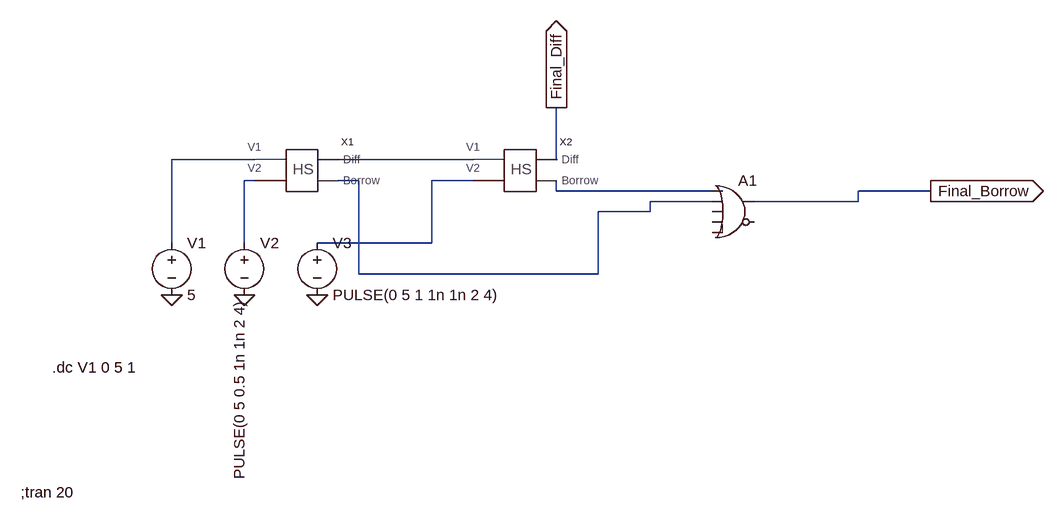
[diagram p0: schematic VTC_Full subtractor.asc]
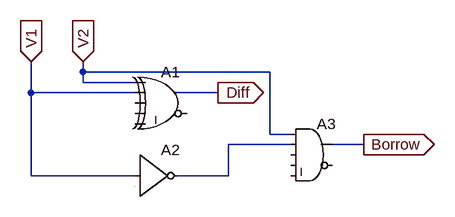
[diagram p1: sub-circuit hs.asc]
VTC_Full subtractor.asc, the LTspice schematic file:
Version 4
SHEET 1 880 680
WIRE -560 -784 -688 -784
WIRE -224 -784 -432 -784
WIRE -96 -784 -96 -864
WIRE -560 -752 -576 -752
WIRE -400 -752 -432 -752
WIRE -224 -752 -288 -752
WIRE -96 -736 -96 -752
WIRE 144 -736 -96 -736
WIRE 480 -736 368 -736
WIRE 144 -720 48 -720
WIRE 368 -720 368 -736
WIRE 368 -720 208 -720
WIRE 48 -704 48 -720
WIRE 48 -704 -32 -704
WIRE -688 -656 -688 -784
WIRE -576 -656 -576 -752
WIRE -288 -656 -288 -752
WIRE -288 -656 -464 -656
WIRE -400 -608 -400 -752
WIRE -32 -608 -32 -704
WIRE -32 -608 -400 -608
FLAG 480 -736 Final_Borrow
IOPIN 480 -736 Out
FLAG -96 -864 Final_Diff
IOPIN -96 -864 Out
FLAG -464 -576 0
FLAG -576 -576 0
FLAG -688 -576 0
SYMBOL HS -464 -768 R0
SYMATTR InstName X1
SYMBOL HS -128 -768 R0
SYMATTR InstName X2
SYMBOL Digital\\or 176 -768 R0
SYMATTR InstName A1
SYMBOL voltage -576 -672 R0
WINDOW 3 -8 104 VRight 2
WINDOW 123 0 0 Left 0
WINDOW 39 0 0 Left 0
SYMATTR Value PULSE(0 5 0.5 1n 1n 2 4)
SYMATTR InstName V2
SYMBOL voltage -464 -672 R0
WINDOW 123 0 0 Left 0
WINDOW 39 0 0 Left 0
SYMATTR InstName V3
SYMATTR Value PULSE(0 5 1 1n 1n 2 4)
SYMBOL voltage -688 -672 R0
WINDOW 123 0 0 Left 0
WINDOW 39 0 0 Left 0
SYMATTR InstName V1
SYMATTR Value 5
TEXT -920 -272 Left 2 !;tran 20
TEXT -872 -464 Left 2 !.dc V1 0 5 1

hs.asc, the sub-circuit schematic file:
Version 4
SHEET 1 880 680
WIRE 64 96 64 80
WIRE 352 96 64 96
WIRE 64 112 64 96
WIRE 144 112 64 112
WIRE -16 128 -16 80
WIRE 144 128 -16 128
WIRE 272 128 208 128
WIRE 352 192 352 96
WIRE 384 192 352 192
WIRE 384 208 288 208
WIRE 496 208 448 208
WIRE -16 256 -16 128
WIRE 144 256 -16 256
WIRE 288 256 288 208
WIRE 288 256 208 256
FLAG -16 80 V1
IOPIN -16 80 In
FLAG 64 80 V2
IOPIN 64 80 In
FLAG 272 128 Diff
IOPIN 272 128 Out
FLAG 496 208 Borrow
IOPIN 496 208 Out
SYMBOL Digital\\xor 192 80 R0
SYMATTR InstName A1
SYMBOL Digital\\inv 144 192 R0
SYMATTR InstName A2
SYMBOL Digital\\and 416 160 R0
SYMATTR InstName A3

The netlist it stands for:
* VTC_Full subtractor.asc
XX1 N001 N003 N002 N004 hs
XX2 N002 N005 Final_Diff N006 hs
A1 N006 N004 0 0 0 0 Final_Borrow 0 OR
V2 N003 0 PULSE(0 5 0.5 1n 1n 2 4)
V3 N005 0 PULSE(0 5 1 1n 1n 2 4)
V1 N001 0 5

* block symbol definitions
.subckt hs V1 V2 Diff Borrow
A1 V2 V1 0 0 0 0 Diff 0 XOR
A2 V1 0 0 0 0 N001 0 0 BUF
A3 V2 N001 0 0 0 0 Borrow 0 AND
.ends hs

;tran 20
.dc V1 0 5 1
.backanno
.end